# Altium schematic sheet LEDChannel.SchDoc
size A
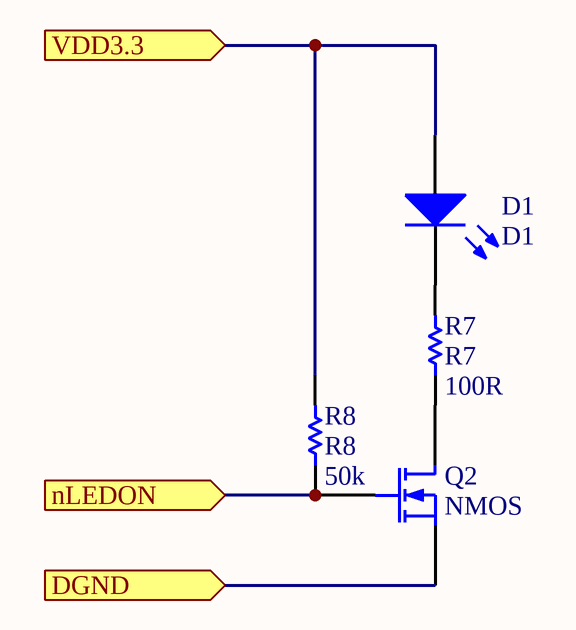
[diagram p0: LEDChannel.SchDoc]

## Parts
D1  D1  [LED_0805_GREEN]
Q2  NMOS  [SOT23-3]
R7  R7  value 100R  [RES_0805]
R8  R8  value 50k  [RES_0805]

## Ports
DGND (in), nLEDON (in), VDD3.3 (in)

## Nets
DGND: Q2.3(S) ; port DGND
nLEDON: Q2.2(G) R8.1 ; port nLEDON
VDD3.3: D1.1(A) R8.2 ; port VDD3.3
NetD1_2: D1.2(K) R7.2
NetQ2_1: Q2.1(D) R7.1

## Library data of the parts
D1 = LED0: Typical INFRARED GaAs LED; Published: 8-Jun-2000; LatestRevisionDate: 08-Jul-2005; LatestRevisionNote: Mech Layer 1 removed.; PackageReference: LED-0; Publisher: Altium Limited; PackageDescription: LED; 2 Leads
Q2 = MOSFET-N: N-Channel MOSFET; pin to pad: 1>3 2>1 3>2; Published: 8-Jun-2000; LatestRevisionDate: 17-Jul-2002; LatestRevisionNote: Re-released for DXP Platform.; PackageVersion: 1995/1996; PackageReference: E3; Publisher: Altium Limited; PackageDescription: TO, Flat Index; 3 In-Line, Axial Leads; Body Dia. 4.6mm; Lead Dia. 0.5 mm (max)
R7 R8 = Res1: Resistor; Published: 8-Jun-2000; LatestRevisionDate: 17-Jul-2002; LatestRevisionNote: Re-released for DXP Platform.; PackageReference: AXIAL-0.3; Publisher: Altium Limited; PackageDescription: Axial Device, Thru-Hole; 2 Leads; 0.3 in Pin Spacing